# EAGLE design TB6612FNG Breakout v11 (EAGLE 5.04)
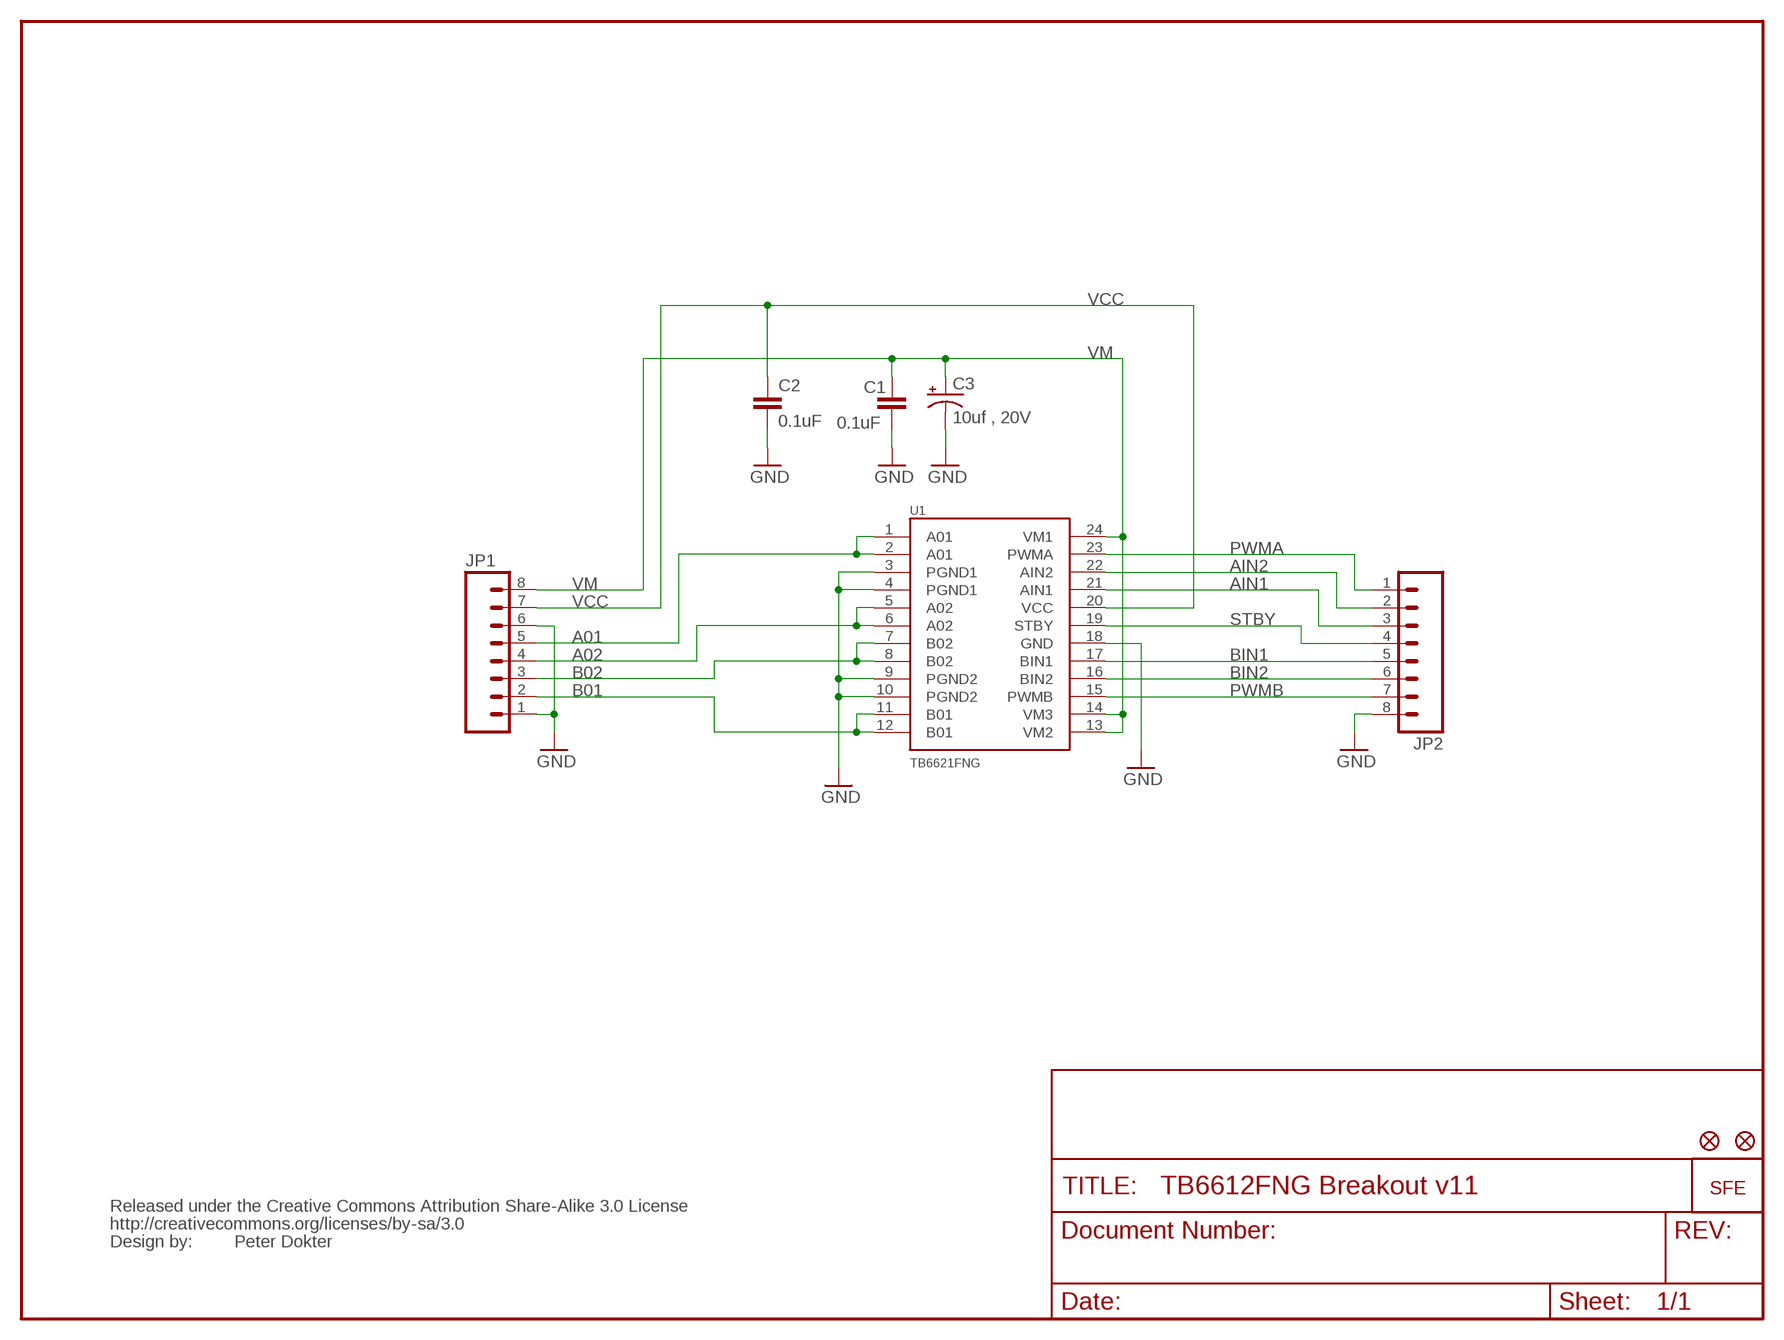
[diagram p0: schematic, sheet 1]

## Parts
C1  0.1uF  CAP0402-CAP  [0402-CAP]
C2  0.1uF  CAP0402-CAP  [0402-CAP]
C3  10uf , 20V  CAP_POL3528  [EIA3528]
JP1  M08LONGPADS  [1X08_LONGPADS]
JP2  M08LONGPADS  [1X08_LONGPADS]
JP4  LOGO-SFESK  [SFE-LOGO-FLAME]
JP5  FIDUCIAL1X2  [FIDUCIAL-1X2]
JP6  FIDUCIAL1X2  [FIDUCIAL-1X2]
U1  TB6621FNG  [SSOP24]
U$1  CREATIVE_COMMONS  [CREATIVE_COMMONS]

## Nets
A01: JP1.5 U1.1(A01) U1.2(A01)
A02: JP1.4 U1.5(A02) U1.6(A02)
AIN1: JP2.3 U1.21(AIN1)
AIN2: JP2.2 U1.22(AIN2)
B01: JP1.2 U1.11(B01) U1.12(B01)
B02: JP1.3 U1.7(B02) U1.8(B02)
BIN1: JP2.5 U1.17(BIN1)
BIN2: JP2.6 U1.16(BIN2)
GND: C1.2 C2.2 C3.C(-) JP1.1 JP1.6 JP2.8 U1.3(PGND1) U1.4(PGND1) U1.9(PGND2) U1.10(PGND2) U1.18(GND)
PWMA: JP2.1 U1.23(PWMA)
PWMB: JP2.7 U1.15(PWMB)
STBY: JP2.4 U1.19(STBY)
VCC: C2.1 JP1.7 U1.20(VCC)
VM: C1.1 C3.A(+) JP1.8 U1.13(VM2) U1.14(VM3) U1.24(VM1)

## Notes on the sheet
- Peter Dokter

## Library data of the parts
C1 C2 = SparkFun:CAP: Capacitor Standard 0603 ceramic capacitor, and 0.1" leaded capacitor.
C3 = SparkFun:CAP_POL: Capacitor Polarized These are standard SMD and PTH capacitors. Normally 10uF, 47uF, and 100uF in electrolytic and tantalum varieties. Always verify the external diameter of the through hole cap, it varies with capacity, voltage, and manufacturer. The EIA devices should be standard.
JP1 JP2 = SparkFun:M08: Header 8 Standard 8-pin 0.1" header. Use with straight break away headers (SKU : PRT-00116), right angle break away headers (PRT-00553), swiss pins (PRT-00743), machine pins (PRT-00117), and female headers (PRT-00115).
JP4 = SparkFun:LOGO-SFE: Spark Fun Electronics PCB Logo This is the standard Spark Fun Electronics PCB logo.
JP5 JP6 = SparkFun:FIDUCIAL: Fiducial Alignment Points Various fiducial points for machine vision alignment.
U1 = SparkFun:TB6621FNG: Toshiba 1A motor driver
U$1 = SparkFun:CREATIVE_COMMONS

## Board
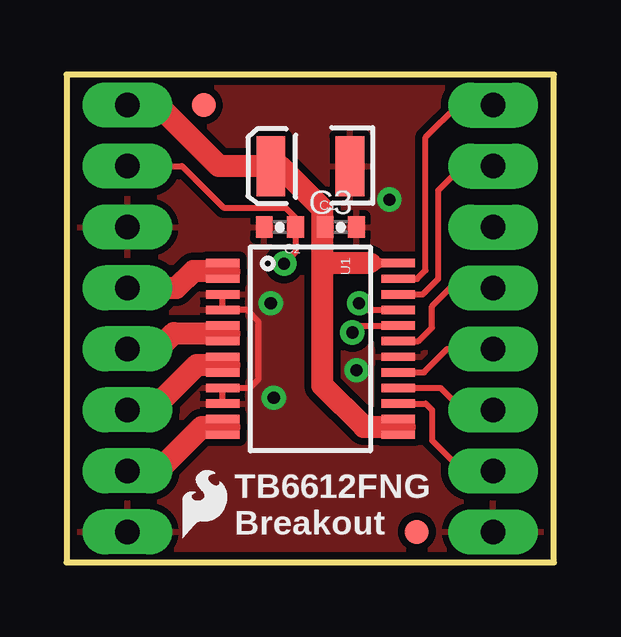
[diagram p1: board, top side]
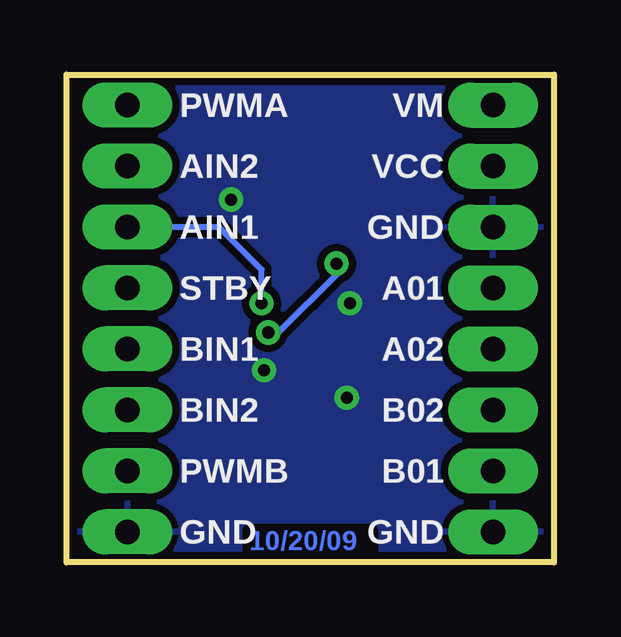
[diagram p2: board, bottom side, seen from below]

Size 20.32 x 20.32 mm. Coordinates in mm from the lower left corner, seen from the top.
Outline: 0,0 20.32,0 20.32,20.32 0,20.32 0,0
Copper layers (1*16): Top 0.035mm / dielectric 1.5mm / Bottom 0.035mm
Design rules "SparkFun": minimum track width 8mil, minimum drill 20mil, track to track 8mil, track to pad 8mil, pad to pad 8mil, via to via 8mil, smd to smd 8mil, copper to edge 9mil, drill to drill 8mil, minimum pad ring 12mil, minimum via ring 10mil, stop-mask expansion 4mil, vias tented up to drill 20mil, thermal gap 10mil

### Footprints (pad centres in the part's own frame; a part is rotated, then mirrored left to right if it is on the bottom)
0402-CAP = smd 0.7 x 0.9: 1 -0.65,0; 2 0.65,0
EIA3528 = smd 1.2 x 2.5: A 1.65,0; C -1.65,0
1X08_LONGPADS = drill 1.016 pad 1.88 long: 1 0,0; 2 2.54,0; 3 5.08,0; 4 7.62,0; 5 10.16,0; 6 12.7,0; 7 15.24,0; 8 17.78,0
FIDUCIAL-1X2 = smd 1 x 1: 1 0,0
SSOP24 = smd 0.348 x 1.397: 1 -3.575,-3.656; 2 -2.925,-3.656; 3 -2.275,-3.656; 4 -1.625,-3.656; 5 -0.975,-3.656; 6 -0.325,-3.656; 7 0.325,-3.656; 8 0.975,-3.656; 9 1.625,-3.656; 10 2.275,-3.656; 11 2.925,-3.656; 12 3.575,-3.656; 13 3.575,3.656; 14 2.925,3.656; 15 2.275,3.656; 16 1.625,3.656; 17 0.975,3.656; 18 0.325,3.656; 19 -0.325,3.656; 20 -0.975,3.656; 21 -1.625,3.656; 22 -2.275,3.656; 23 -2.925,3.656; 24 -3.575,3.656

### Placement (x,y rotation side)
C1  11.43,13.97 0 top
C2  8.89,13.97 180 top
C3  10.16,16.51 180 top
JP1  2.54,1.27 90 top
JP2  17.78,19.05 270 top
JP4  4.83,1.02 0 top
JP5  14.61,1.27 0 top
JP6  5.71,19.05 0 top
U1  10.16,8.89 270 top
U$1  21.59,-8.89 0 top  (outside the outline)

### Tracks (layer width: path | path; a pad name or v marks a point on that pad's centre or on a via)
A01
  Top 0.254: U1.1 6.5,12.29 6.35,12.14 6.5,11.99 U1.2
  Top 0.914: 6.78,12.12 6.76,12.14 6.35,12.14 5.28,12.14 4.57,11.43 JP1.5
A02
  Top 0.254: U1.5 6.5,9.7 6.35,9.55 6.5,9.4 U1.6
  Top 0.914: 6.78,9.53 6.76,9.55 6.35,9.55 4.47,9.55 3.81,8.89 JP1.4
AIN1  (via drill 0.51)
  Top 0.254: U1.21 12.47,10.52 v12.19,10.79
  Bottom 0.254: v12.19,10.79 12.19,12.19 13.97,13.97 JP2.3
AIN2
  Top 0.254: U1.22 14.85,11.16 15.49,11.81 15.49,15.49 16.51,16.51 JP2.2
B01
  Top 0.254: U1.12 6.5,5.49 6.35,5.64 6.5,5.79 U1.11
  Top 0.914: 6.78,5.64 6.35,5.64 5.64,5.64 3.81,3.81 JP1.2
B02
  Top 0.254: U1.8 6.5,8.08 6.35,8.23 6.5,8.38 U1.7
  Top 0.914: 6.78,8.23 6.35,8.23 5.44,8.23 3.56,6.35 JP1.3
BIN1
  Top 0.254: U1.17 14.9,7.92 15.88,8.89 JP2.5
BIN2
  Top 0.254: U1.16 15.6,7.26 16.51,6.35 JP2.6
GND  (via drill 0.51)
  Top 0.254: U1.10 U1.9 7.65,7.26 8,7.62 8,10.03 7.52,10.52 U1.4 U1.3
  other vias: 12.09,8 13.46,15.11 8.51,10.79 8.64,6.86
  pour Top (isolate 0.305): 0,0 20.32,0 20.32,20.32 0,20.32
  pour Bottom (isolate 0.305): 0,0 20.32,0 20.32,20.32 0,20.32
PWMA
  Top 0.254: U1.23 14.61,11.81 14.96,12.17 14.96,17.7 16.31,19.05 JP2.1
PWMB
  Top 0.254: U1.15 14.97,6.62 15.24,6.35 15.24,5.08 16.51,3.81 JP2.7
STBY
  Top 0.254: U1.19 14.68,9.21 15.24,9.78 15.24,10.67 16,11.43 JP2.4
VCC  (via drill 0.51)
  Top 0.254: JP1.7 4.81,16.51 6.54,14.78 9.12,14.78 9.54,14.36 C2.1 9.54,12.92 v9.07,12.45 | U1.20 12.2,9.87 v11.91,9.58
  Bottom 0.254: v9.07,12.45 9.07,11.99 11.48,9.58 v11.91,9.58
VM
  Top 0.254: 10.67,13.97 C1.1 | U1.14 13.82,5.79 13.97,5.64 13.82,5.49 U1.13
  Top 0.356: U1.24 13.06,12.46 13.06,12.47
  Top 0.406: 13.06,12.46 12.83,12.46 12.95,12.47
  Top 0.61: 12.83,12.46 12.58,12.46 12.7,12.47
  Top 0.813: 12.57,12.47 12.7,12.47
  Top 0.914: 10.67,12.7 10.67,7.37 12.39,5.64 13.97,5.64 14.1,5.64 | 10.67,12.7 10.67,13.97 10.67,14.73 8.89,16.51 C3.A 6.35,16.51 3.81,19.05 JP1.8 | 12.57,12.47 10.9,12.47 10.67,12.7

### Text on the board
Bottom: 10/20/09
tPlace: TB6612FNG | Breakout
bPlace: VM | PWMA | VCC | AIN2 | GND | AIN1 | A01 | STBY | A02 | BIN1 | B02 | BIN2 | B01 | PWMB | GND | GND